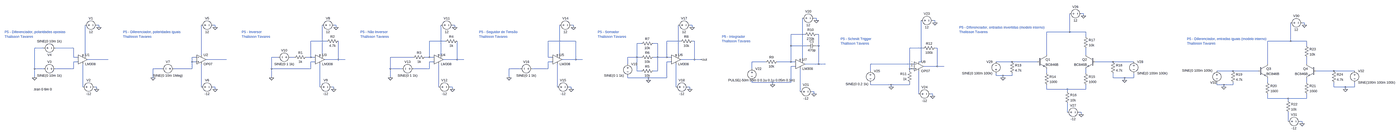
[diagram p0: schematic P5 - Operational amplifier.asc, whole sheet]
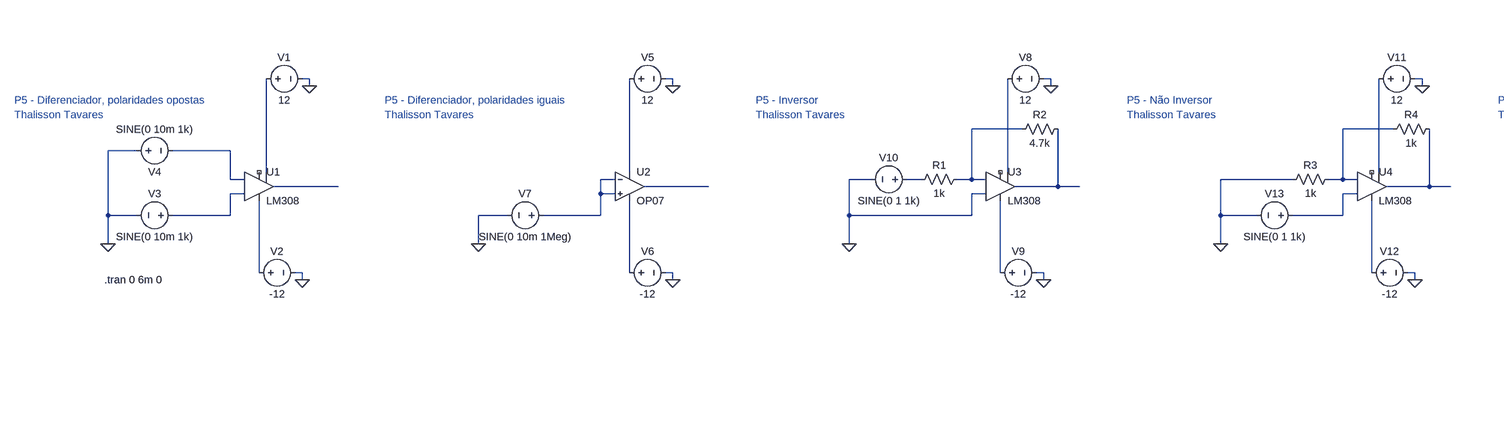
[diagram p1: schematic P5 - Operational amplifier.asc, part, row 1 of 1, column 1 of 3]
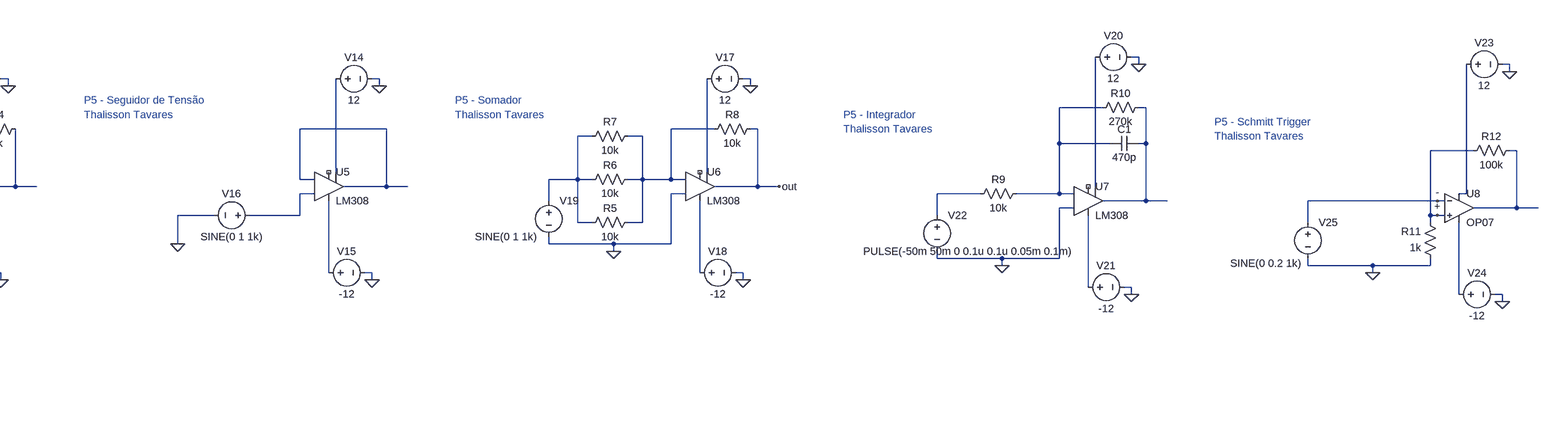
[diagram p2: schematic P5 - Operational amplifier.asc, part, row 1 of 1, column 2 of 3]
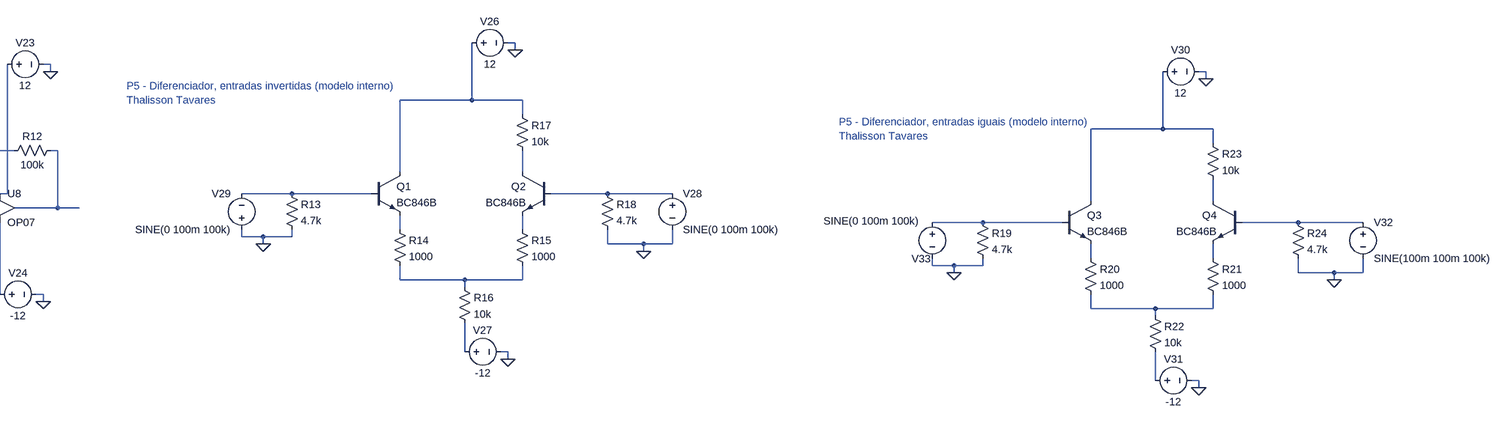
[diagram p3: schematic P5 - Operational amplifier.asc, part, row 1 of 1, column 3 of 3]
P5 - Operational amplifier.asc, the LTspice schematic file:
Version 4
SHEET 1 10020 904
WIRE 7504 -272 7488 -272
WIRE 7504 -256 7504 -272
WIRE 5360 -240 5344 -240
WIRE 5360 -224 5360 -240
WIRE 6416 -224 6400 -224
WIRE 6416 -208 6416 -224
WIRE 9296 -208 9280 -208
WIRE -112 -192 -128 -192
WIRE 784 -192 768 -192
WIRE 1696 -192 1680 -192
WIRE 2560 -192 2544 -192
WIRE 3520 -192 3504 -192
WIRE 4400 -192 4384 -192
WIRE 9296 -192 9296 -208
WIRE -112 -176 -112 -192
WIRE 784 -176 784 -192
WIRE 1696 -176 1696 -192
WIRE 2560 -176 2560 -192
WIRE 3520 -176 3520 -192
WIRE 4400 -176 4400 -192
WIRE 7408 -144 7408 -272
WIRE 7408 -144 7248 -144
WIRE 7520 -144 7408 -144
WIRE 5280 -128 5184 -128
WIRE 5376 -128 5360 -128
WIRE 7520 -112 7520 -144
WIRE 1632 -80 1520 -80
WIRE 2496 -80 2384 -80
WIRE 3536 -80 3344 -80
WIRE 4320 -80 4224 -80
WIRE 4416 -80 4400 -80
WIRE 9200 -80 9200 -208
WIRE 9200 -80 9040 -80
WIRE 9312 -80 9200 -80
WIRE 4048 -64 4016 -64
WIRE 4160 -64 4128 -64
WIRE 5184 -48 5184 -128
WIRE 5296 -48 5184 -48
WIRE 5376 -48 5376 -128
WIRE 5376 -48 5360 -48
WIRE 9312 -48 9312 -80
WIRE -496 -32 -560 -32
WIRE -288 -32 -416 -32
WIRE 6336 -32 6240 -32
WIRE 6432 -32 6416 -32
WIRE -208 16 -208 -192
WIRE 688 16 688 -192
WIRE 1600 16 1600 -192
WIRE 2464 16 2464 -192
WIRE 3424 16 3424 -192
WIRE 4304 16 4304 -192
WIRE 7248 16 7248 -144
WIRE 7520 16 7520 -32
WIRE -288 32 -288 -32
WIRE -256 32 -288 32
WIRE 656 32 624 32
WIRE 1296 32 1248 32
WIRE 1408 32 1376 32
WIRE 1520 32 1520 -80
WIRE 1520 32 1488 32
WIRE 1552 32 1520 32
WIRE 2272 32 2112 32
WIRE 2384 32 2384 -80
WIRE 2384 32 2352 32
WIRE 2416 32 2384 32
WIRE 3344 32 3344 -80
WIRE 3376 32 3344 32
WIRE 4016 32 4016 -64
WIRE 4016 32 3952 32
WIRE 4048 32 4016 32
WIRE 4160 32 4160 -64
WIRE 4160 32 4128 32
WIRE 4224 32 4224 -80
WIRE 4224 32 4160 32
WIRE 4256 32 4224 32
WIRE -48 48 -192 48
WIRE 864 48 720 48
WIRE 1712 48 1712 -80
WIRE 1712 48 1616 48
WIRE 1760 48 1712 48
WIRE 2576 48 2576 -80
WIRE 2576 48 2480 48
WIRE 2624 48 2576 48
WIRE 3536 48 3536 -80
WIRE 3536 48 3440 48
WIRE 3584 48 3536 48
WIRE 4416 48 4416 -80
WIRE 4416 48 4320 48
WIRE 4464 48 4416 48
WIRE 5264 48 5264 -240
WIRE -256 64 -288 64
WIRE 624 64 624 32
WIRE 656 64 624 64
WIRE 1552 64 1520 64
WIRE 2416 64 2384 64
WIRE 3376 64 3344 64
WIRE 4256 64 4224 64
WIRE 5008 64 4912 64
WIRE 5184 64 5184 -48
WIRE 5184 64 5088 64
WIRE 5216 64 5184 64
WIRE 6320 64 6320 -224
WIRE 6320 64 6304 64
WIRE 7008 64 6896 64
WIRE 7184 64 7008 64
WIRE 7776 64 7584 64
WIRE 7920 64 7776 64
WIRE 3952 80 3952 32
WIRE 5376 80 5376 -48
WIRE 5376 80 5280 80
WIRE 5424 80 5376 80
WIRE 6256 80 5968 80
WIRE 6272 80 6256 80
WIRE 9040 80 9040 -80
WIRE 9312 80 9312 32
WIRE 5216 96 5184 96
WIRE 6432 96 6432 -32
WIRE 6432 96 6336 96
WIRE 6480 96 6432 96
WIRE -560 112 -560 -32
WIRE -496 112 -560 112
WIRE -288 112 -288 64
WIRE -288 112 -416 112
WIRE 416 112 352 112
WIRE 624 112 624 64
WIRE 624 112 496 112
WIRE 1248 112 1248 32
WIRE 1520 112 1520 64
WIRE 1520 112 1248 112
WIRE 2112 112 2112 32
WIRE 2192 112 2112 112
WIRE 2384 112 2384 64
WIRE 2384 112 2272 112
WIRE 3152 112 3072 112
WIRE 3344 112 3344 64
WIRE 3344 112 3232 112
WIRE 4912 112 4912 64
WIRE 6240 112 6240 -32
WIRE 6256 112 6240 112
WIRE 6272 112 6256 112
WIRE 4016 128 4016 32
WIRE 4048 128 4016 128
WIRE 4160 128 4160 32
WIRE 4160 128 4128 128
WIRE 5968 128 5968 80
WIRE 6240 128 6240 112
WIRE 8800 128 8688 128
WIRE 8976 128 8800 128
WIRE 9568 128 9376 128
WIRE 9712 128 9568 128
WIRE 7248 144 7248 112
WIRE 7520 144 7520 112
WIRE 6896 160 6896 144
WIRE 6944 160 6896 160
WIRE 7008 160 7008 144
WIRE 7008 160 6944 160
WIRE -560 176 -560 112
WIRE 352 176 352 112
WIRE 1248 176 1248 112
WIRE 2112 176 2112 112
WIRE 3072 176 3072 112
WIRE 3952 176 3952 160
WIRE 4096 176 3952 176
WIRE 4224 176 4224 64
WIRE 4224 176 4096 176
WIRE 6944 176 6944 160
WIRE 7776 176 7776 144
WIRE 7856 176 7776 176
WIRE 7920 176 7920 144
WIRE 7920 176 7856 176
WIRE 4096 192 4096 176
WIRE 7856 192 7856 176
WIRE 4912 208 4912 192
WIRE 5056 208 4912 208
WIRE 5184 208 5184 96
WIRE 5184 208 5056 208
WIRE 9040 208 9040 176
WIRE 9312 208 9312 176
WIRE 5056 224 5056 208
WIRE 5968 224 5968 208
WIRE 6112 224 5968 224
WIRE 6240 224 6240 208
WIRE 6240 224 6112 224
WIRE 8688 224 8688 208
WIRE 8736 224 8688 224
WIRE 8800 224 8800 208
WIRE 8800 224 8736 224
WIRE -224 240 -224 80
WIRE -128 240 -144 240
WIRE 688 240 688 80
WIRE 784 240 768 240
WIRE 1584 240 1584 80
WIRE 1680 240 1664 240
WIRE 2448 240 2448 80
WIRE 2544 240 2528 240
WIRE 3408 240 3408 80
WIRE 3504 240 3488 240
WIRE 4288 240 4288 80
WIRE 4384 240 4368 240
WIRE 6112 240 6112 224
WIRE 8736 240 8736 224
WIRE 9568 240 9568 208
WIRE 9648 240 9568 240
WIRE 9712 240 9712 208
WIRE 9712 240 9648 240
WIRE -128 256 -128 240
WIRE 784 256 784 240
WIRE 1680 256 1680 240
WIRE 2544 256 2544 240
WIRE 3504 256 3504 240
WIRE 4384 256 4384 240
WIRE 7248 256 7248 224
WIRE 7392 256 7248 256
WIRE 7520 256 7520 224
WIRE 7520 256 7392 256
WIRE 9648 256 9648 240
WIRE 5248 272 5248 112
WIRE 5344 272 5328 272
WIRE 7392 272 7392 256
WIRE 5344 288 5344 272
WIRE 6304 288 6304 128
WIRE 6400 288 6384 288
WIRE 6400 304 6400 288
WIRE 9040 320 9040 288
WIRE 9184 320 9040 320
WIRE 9312 320 9312 288
WIRE 9312 320 9184 320
WIRE 9184 336 9184 320
WIRE 7392 416 7392 352
WIRE 7488 416 7472 416
WIRE 7488 432 7488 416
WIRE 9184 480 9184 416
WIRE 9280 480 9264 480
WIRE 9280 496 9280 480
FLAG -560 176 0
FLAG -112 -176 0
FLAG -128 256 0
FLAG 352 176 0
FLAG 784 -176 0
FLAG 784 256 0
FLAG 1248 176 0
FLAG 1696 -176 0
FLAG 1680 256 0
FLAG 2112 176 0
FLAG 2560 -176 0
FLAG 2544 256 0
FLAG 3072 176 0
FLAG 3520 -176 0
FLAG 3504 256 0
FLAG 4096 192 0
FLAG 4400 -176 0
FLAG 4384 256 0
FLAG 4464 48 out
FLAG 5056 224 0
FLAG 5360 -224 0
FLAG 5344 288 0
FLAG 6112 240 0
FLAG 6416 -208 0
FLAG 6400 304 0
FLAG 6256 112 +
FLAG 6256 80 -
FLAG 7488 432 0
FLAG 7504 -256 0
FLAG 7856 192 0
FLAG 6944 176 0
FLAG 9280 496 0
FLAG 9296 -192 0
FLAG 9648 256 0
FLAG 8736 240 0
SYMBOL OpAmps\\LM308 -224 -16 R0
SYMATTR InstName U1
SYMBOL voltage -224 -192 R270
WINDOW 0 32 56 VTop 2
WINDOW 3 -32 56 VBottom 2
WINDOW 123 0 0 Left 0
WINDOW 39 0 0 Left 0
SYMATTR InstName V1
SYMATTR Value 12
SYMBOL voltage -240 240 R270
WINDOW 0 32 56 VTop 2
WINDOW 3 -32 56 VBottom 2
WINDOW 123 0 0 Left 0
WINDOW 39 0 0 Left 0
SYMATTR InstName V2
SYMATTR Value -12
SYMBOL voltage -400 112 R90
WINDOW 0 -32 56 VBottom 2
WINDOW 3 32 56 VTop 2
WINDOW 123 0 0 Left 0
WINDOW 39 0 0 Left 0
SYMATTR InstName V3
SYMATTR Value SINE(0 10m 1k)
SYMBOL voltage -512 -32 R270
WINDOW 0 -32 56 VBottom 2
WINDOW 3 32 56 VTop 2
WINDOW 123 0 0 Left 0
WINDOW 39 0 0 Left 0
SYMATTR InstName V4
SYMATTR Value SINE(0 10m 1k)
SYMBOL voltage 672 -192 R270
WINDOW 0 32 56 VTop 2
WINDOW 3 -32 56 VBottom 2
WINDOW 123 0 0 Left 0
WINDOW 39 0 0 Left 0
SYMATTR InstName V5
SYMATTR Value 12
SYMBOL voltage 672 240 R270
WINDOW 0 32 56 VTop 2
WINDOW 3 -32 56 VBottom 2
WINDOW 123 0 0 Left 0
WINDOW 39 0 0 Left 0
SYMATTR InstName V6
SYMATTR Value -12
SYMBOL voltage 512 112 R90
WINDOW 0 -32 56 VBottom 2
WINDOW 3 32 56 VTop 2
WINDOW 123 0 0 Left 0
WINDOW 39 0 0 Left 0
SYMATTR InstName V7
SYMATTR Value SINE(0 10m 1Meg)
SYMBOL OpAmps\\OP07 688 -16 R0
SYMATTR InstName U2
SYMBOL OpAmps\\LM308 1584 -16 R0
SYMATTR InstName U3
SYMBOL voltage 1584 -192 R270
WINDOW 0 32 56 VTop 2
WINDOW 3 -32 56 VBottom 2
WINDOW 123 0 0 Left 0
WINDOW 39 0 0 Left 0
SYMATTR InstName V8
SYMATTR Value 12
SYMBOL voltage 1568 240 R270
WINDOW 0 32 56 VTop 2
WINDOW 3 -32 56 VBottom 2
WINDOW 123 0 0 Left 0
WINDOW 39 0 0 Left 0
SYMATTR InstName V9
SYMATTR Value -12
SYMBOL voltage 1392 32 R90
WINDOW 0 -32 56 VBottom 2
WINDOW 3 32 56 VTop 2
WINDOW 123 0 0 Left 0
WINDOW 39 0 0 Left 0
SYMATTR InstName V10
SYMATTR Value SINE(0 1 1k)
SYMBOL res 1504 16 R90
WINDOW 0 0 56 VBottom 2
WINDOW 3 32 56 VTop 2
SYMATTR InstName R1
SYMATTR Value 1k
SYMBOL res 1728 -96 R90
WINDOW 0 0 56 VBottom 2
WINDOW 3 32 56 VTop 2
SYMATTR InstName R2
SYMATTR Value 4.7k
SYMBOL OpAmps\\LM308 2448 -16 R0
SYMATTR InstName U4
SYMBOL voltage 2448 -192 R270
WINDOW 0 32 56 VTop 2
WINDOW 3 -32 56 VBottom 2
WINDOW 123 0 0 Left 0
WINDOW 39 0 0 Left 0
SYMATTR InstName V11
SYMATTR Value 12
SYMBOL voltage 2432 240 R270
WINDOW 0 32 56 VTop 2
WINDOW 3 -32 56 VBottom 2
WINDOW 123 0 0 Left 0
WINDOW 39 0 0 Left 0
SYMATTR InstName V12
SYMATTR Value -12
SYMBOL voltage 2288 112 R90
WINDOW 0 -32 56 VBottom 2
WINDOW 3 32 56 VTop 2
WINDOW 123 0 0 Left 0
WINDOW 39 0 0 Left 0
SYMATTR InstName V13
SYMATTR Value SINE(0 1 1k)
SYMBOL res 2368 16 R90
WINDOW 0 0 56 VBottom 2
WINDOW 3 32 56 VTop 2
SYMATTR InstName R3
SYMATTR Value 1k
SYMBOL res 2592 -96 R90
WINDOW 0 0 56 VBottom 2
WINDOW 3 32 56 VTop 2
SYMATTR InstName R4
SYMATTR Value 1k
SYMBOL OpAmps\\LM308 3408 -16 R0
SYMATTR InstName U5
SYMBOL voltage 3408 -192 R270
WINDOW 0 32 56 VTop 2
WINDOW 3 -32 56 VBottom 2
WINDOW 123 0 0 Left 0
WINDOW 39 0 0 Left 0
SYMATTR InstName V14
SYMATTR Value 12
SYMBOL voltage 3392 240 R270
WINDOW 0 32 56 VTop 2
WINDOW 3 -32 56 VBottom 2
WINDOW 123 0 0 Left 0
WINDOW 39 0 0 Left 0
SYMATTR InstName V15
SYMATTR Value -12
SYMBOL voltage 3248 112 R90
WINDOW 0 -32 56 VBottom 2
WINDOW 3 32 56 VTop 2
WINDOW 123 0 0 Left 0
WINDOW 39 0 0 Left 0
SYMATTR InstName V16
SYMATTR Value SINE(0 1 1k)
SYMBOL OpAmps\\LM308 4288 -16 R0
SYMATTR InstName U6
SYMBOL voltage 4288 -192 R270
WINDOW 0 32 56 VTop 2
WINDOW 3 -32 56 VBottom 2
WINDOW 123 0 0 Left 0
WINDOW 39 0 0 Left 0
SYMATTR InstName V17
SYMATTR Value 12
SYMBOL voltage 4272 240 R270
WINDOW 0 32 56 VTop 2
WINDOW 3 -32 56 VBottom 2
WINDOW 123 0 0 Left 0
WINDOW 39 0 0 Left 0
SYMATTR InstName V18
SYMATTR Value -12
SYMBOL voltage 3952 64 R0
WINDOW 3 -164 96 Left 2
WINDOW 123 0 0 Left 0
WINDOW 39 0 0 Left 0
SYMATTR InstName V19
SYMATTR Value SINE(0 1 1k)
SYMBOL res 4144 112 R90
WINDOW 0 0 56 VBottom 2
WINDOW 3 32 56 VTop 2
SYMATTR InstName R5
SYMATTR Value 10k
SYMBOL res 4144 16 R90
WINDOW 0 0 56 VBottom 2
WINDOW 3 32 56 VTop 2
SYMATTR InstName R6
SYMATTR Value 10k
SYMBOL res 4144 -80 R90
WINDOW 0 0 56 VBottom 2
WINDOW 3 32 56 VTop 2
SYMATTR InstName R7
SYMATTR Value 10k
SYMBOL res 4416 -96 R90
WINDOW 0 0 56 VBottom 2
WINDOW 3 32 56 VTop 2
SYMATTR InstName R8
SYMATTR Value 10k
SYMBOL OpAmps\\LM308 5248 16 R0
SYMATTR InstName U7
SYMBOL voltage 5248 -240 R270
WINDOW 0 32 56 VTop 2
WINDOW 3 -32 56 VBottom 2
WINDOW 123 0 0 Left 0
WINDOW 39 0 0 Left 0
SYMATTR InstName V20
SYMATTR Value 12
SYMBOL voltage 5232 272 R270
WINDOW 0 32 56 VTop 2
WINDOW 3 -32 56 VBottom 2
WINDOW 123 0 0 Left 0
WINDOW 39 0 0 Left 0
SYMATTR InstName V21
SYMATTR Value -12
SYMBOL voltage 4912 96 R0
WINDOW 3 -164 96 Left 2
WINDOW 123 0 0 Left 0
WINDOW 39 0 0 Left 0
SYMATTR InstName V22
SYMATTR Value PULSE(-50m 50m 0 0.1u 0.1u 0.05m 0.1m)
SYMBOL res 5104 48 R90
WINDOW 0 0 56 VBottom 2
WINDOW 3 32 56 VTop 2
SYMATTR InstName R9
SYMATTR Value 10k
SYMBOL res 5376 -144 R90
WINDOW 0 0 56 VBottom 2
WINDOW 3 32 56 VTop 2
SYMATTR InstName R10
SYMATTR Value 270k
SYMBOL cap 5360 -64 R90
WINDOW 0 0 32 VBottom 2
WINDOW 3 32 32 VTop 2
SYMATTR InstName C1
SYMATTR Value 470p
SYMBOL voltage 6304 -224 R270
WINDOW 0 32 56 VTop 2
WINDOW 3 -32 56 VBottom 2
WINDOW 123 0 0 Left 0
WINDOW 39 0 0 Left 0
SYMATTR InstName V23
SYMATTR Value 12
SYMBOL voltage 6288 288 R270
WINDOW 0 32 56 VTop 2
WINDOW 3 -32 56 VBottom 2
WINDOW 123 0 0 Left 0
WINDOW 39 0 0 Left 0
SYMATTR InstName V24
SYMATTR Value -12
SYMBOL voltage 5968 112 R0
WINDOW 3 -173 107 Left 2
WINDOW 123 0 0 Left 0
WINDOW 39 0 0 Left 0
SYMATTR InstName V25
SYMATTR Value SINE(0 0.2 1k)
SYMBOL res 6256 224 R180
WINDOW 0 36 76 Left 2
WINDOW 3 36 40 Left 2
SYMATTR InstName R11
SYMATTR Value 1k
SYMBOL res 6432 -48 R90
WINDOW 0 0 56 VBottom 2
WINDOW 3 32 56 VTop 2
SYMATTR InstName R12
SYMATTR Value 100k
SYMBOL OpAmps\\OP07 6304 32 R0
SYMATTR InstName U8
SYMBOL npn 7184 16 R0
SYMATTR InstName Q1
SYMATTR Value BC846B
SYMBOL npn 7584 16 M0
SYMATTR InstName Q2
SYMATTR Value BC846B
SYMBOL res 6992 48 R0
SYMATTR InstName R13
SYMATTR Value 4.7k
SYMBOL res 7232 128 R0
SYMATTR InstName R14
SYMATTR Value 1000
SYMBOL res 7504 128 R0
SYMATTR InstName R15
SYMATTR Value 1000
SYMBOL res 7376 256 R0
SYMATTR InstName R16
SYMATTR Value 10k
SYMBOL res 7504 -128 R0
SYMATTR InstName R17
SYMATTR Value 10k
SYMBOL res 7760 48 R0
SYMATTR InstName R18
SYMATTR Value 4.7k
SYMBOL voltage 7392 -272 R270
WINDOW 0 32 56 VTop 2
WINDOW 3 -32 56 VBottom 2
WINDOW 123 0 0 Left 0
WINDOW 39 0 0 Left 0
SYMATTR InstName V26
SYMATTR Value 12
SYMBOL voltage 7376 416 R270
WINDOW 0 32 56 VTop 2
WINDOW 3 -32 56 VBottom 2
WINDOW 123 0 0 Left 0
WINDOW 39 0 0 Left 0
SYMATTR InstName V27
SYMATTR Value -12
SYMBOL voltage 7920 48 R0
WINDOW 123 0 0 Left 0
WINDOW 39 0 0 Left 0
SYMATTR InstName V28
SYMATTR Value SINE(0 100m 100k)
SYMBOL voltage 6896 160 R180
WINDOW 0 24 96 Left 2
WINDOW 3 24 16 Left 2
WINDOW 123 0 0 Left 0
WINDOW 39 0 0 Left 0
SYMATTR InstName V29
SYMATTR Value SINE(0 100m 100k)
SYMBOL npn 8976 80 R0
SYMATTR InstName Q3
SYMATTR Value BC846B
SYMBOL npn 9376 80 M0
SYMATTR InstName Q4
SYMATTR Value BC846B
SYMBOL res 8784 112 R0
SYMATTR InstName R19
SYMATTR Value 4.7k
SYMBOL res 9024 192 R0
SYMATTR InstName R20
SYMATTR Value 1000
SYMBOL res 9296 192 R0
SYMATTR InstName R21
SYMATTR Value 1000
SYMBOL res 9168 320 R0
SYMATTR InstName R22
SYMATTR Value 10k
SYMBOL res 9296 -64 R0
SYMATTR InstName R23
SYMATTR Value 10k
SYMBOL res 9552 112 R0
SYMATTR InstName R24
SYMATTR Value 4.7k
SYMBOL voltage 9184 -208 R270
WINDOW 0 32 56 VTop 2
WINDOW 3 -32 56 VBottom 2
WINDOW 123 0 0 Left 0
WINDOW 39 0 0 Left 0
SYMATTR InstName V30
SYMATTR Value 12
SYMBOL voltage 9168 480 R270
WINDOW 0 32 56 VTop 2
WINDOW 3 -32 56 VBottom 2
WINDOW 123 0 0 Left 0
WINDOW 39 0 0 Left 0
SYMATTR InstName V31
SYMATTR Value -12
SYMBOL voltage 9712 112 R0
WINDOW 123 0 0 Left 0
WINDOW 39 0 0 Left 0
SYMATTR InstName V32
SYMATTR Value SINE(100m 100m 100k)
SYMBOL voltage 8688 112 R0
WINDOW 0 -46 97 Left 2
WINDOW 3 -242 13 Left 2
WINDOW 123 0 0 Left 0
WINDOW 39 0 0 Left 0
SYMATTR InstName V33
SYMATTR Value SINE(0 100m 100k)
TEXT -768 -144 Left 2 ;P5 - Diferenciador, polaridades opostas
TEXT -768 -112 Left 2 ;Thalisson Tavares
TEXT -568 256 Left 2 !.tran 0 6m 0
TEXT 144 -144 Left 2 ;P5 - Diferenciador, polaridades iguais
TEXT 144 -112 Left 2 ;Thalisson Tavares
TEXT 1040 -144 Left 2 ;P5 - Inversor
TEXT 1040 -112 Left 2 ;Thalisson Tavares
TEXT 1904 -144 Left 2 ;P5 - Não Inversor
TEXT 1904 -112 Left 2 ;Thalisson Tavares
TEXT 2864 -144 Left 2 ;P5 - Seguidor de Tensão
TEXT 2864 -112 Left 2 ;Thalisson Tavares
TEXT 3744 -144 Left 2 ;P5 - Somador
TEXT 3744 -112 Left 2 ;Thalisson Tavares
TEXT 4704 -112 Left 2 ;P5 - Integrador
TEXT 4704 -80 Left 2 ;Thalisson Tavares
TEXT 5760 -96 Left 2 ;P5 - Schmitt Trigger
TEXT 5760 -64 Left 2 ;Thalisson Tavares
TEXT 6640 -176 Left 2 ;P5 - Diferenciador, entradas invertidas (modelo interno)
TEXT 6640 -144 Left 2 ;Thalisson Tavares
TEXT 8480 -96 Left 2 ;P5 - Diferenciador, entradas iguais (modelo interno)
TEXT 8480 -64 Left 2 ;Thalisson Tavares

The netlist it stands for:
* P5 - Operational amplifier.asc
XU1 N026 N010 N012 N040 N021 NC_01 NC_02 LT1008
V1 N012 0 12
V2 N040 0 -12
V3 N026 0 SINE(0 10m 1k)
V4 0 N010 SINE(0 10m 1k)
V5 N013 0 12
V6 N041 0 -12
V7 N019 0 SINE(0 10m 1Meg)
XU2 N019 N019 N013 N041 N022 LT1001  ; OP07, pins In+ In- V+ V- OUT
XU3 0 N004 N014 N042 N023 NC_03 NC_04 LT1008
V8 N014 0 12
V9 N042 0 -12
V10 N020 0 SINE(0 1 1k)
R1 N004 N020 1k
R2 N023 N004 4.7k
XU4 N027 N005 N015 N043 N024 NC_05 NC_06 LT1008
V11 N015 0 12
V12 N043 0 -12
V13 N027 0 SINE(0 1 1k)
R3 N005 0 1k
R4 N024 N005 1k
XU5 N028 N006 N016 N044 N006 NC_07 NC_08 LT1008
V14 N016 0 12
V15 N044 0 -12
V16 N028 0 SINE(0 1 1k)
XU6 0 N007 N017 N045 out NC_09 NC_10 LT1008
V17 N017 0 12
V18 N045 0 -12
V19 N009 0 SINE(0 1 1k)
R5 N007 N009 10k
R6 N007 N009 10k
R7 N007 N009 10k
R8 out N007 10k
XU7 0 N002 N025 N047 N003 NC_11 NC_12 LT1008
V20 N025 0 12
V21 N047 0 -12
V22 N029 0 PULSE(-50m 50m 0 0.1u 0.1u 0.05m 0.1m)
R9 N002 N029 10k
R10 N003 N002 270k
C1 N003 N002 470p
V23 N030 0 12
V24 N048 0 -12
V25 - 0 SINE(0 0.2 1k)
R11 0 + 1k
R12 N011 + 100k
XU8 + - N030 N048 N011 LT1001  ; OP07, pins In+ In- V+ V- OUT
Q1 N001 N031 N036 0 BC846B
Q2 N018 N032 N037 0 BC846B
R13 N031 0 4.7k
R14 N036 N046 1000
R15 N037 N046 1000
R16 N046 N050 10k
R17 N001 N018 10k
R18 N032 0 4.7k
V26 N001 0 12
V27 N050 0 -12
V28 N032 0 SINE(0 100m 100k)
V29 0 N031 SINE(0 100m 100k)
Q3 N008 N034 N038 0 BC846B
Q4 N033 N035 N039 0 BC846B
R19 N034 0 4.7k
R20 N038 N049 1000
R21 N039 N049 1000
R22 N049 N051 10k
R23 N008 N033 10k
R24 N035 0 4.7k
V30 N008 0 12
V31 N051 0 -12
V32 N035 0 SINE(100m 100m 100k)
V33 N034 0 SINE(0 100m 100k)
.model NPN NPN
.model PNP PNP
.lib standard.bjt
* P5 - Diferenciador, polaridades opostas
* Thalisson Tavares
.tran 0 6m 0
* P5 - Diferenciador, polaridades iguais
* Thalisson Tavares
* P5 - Inversor
* Thalisson Tavares
* P5 - Não Inversor
* Thalisson Tavares
* P5 - Seguidor de Tensão
* Thalisson Tavares
* P5 - Somador
* Thalisson Tavares
* P5 - Integrador
* Thalisson Tavares
* P5 - Schmitt Trigger
* Thalisson Tavares
* P5 - Diferenciador, entradas invertidas (modelo interno)
* Thalisson Tavares
* P5 - Diferenciador, entradas iguais (modelo interno)
* Thalisson Tavares
.lib LTC.lib
.backanno
.end